# Altium schematic sheet Processor.SchDoc: MCU STM32F407VG6
size A4; Organization: Gadget Sandbox; SheetNumber: 3; SheetTotal: 5; License: CC-BY-SA 3.0; Version: 0.1 pre-alpha; Project: NeoCortex
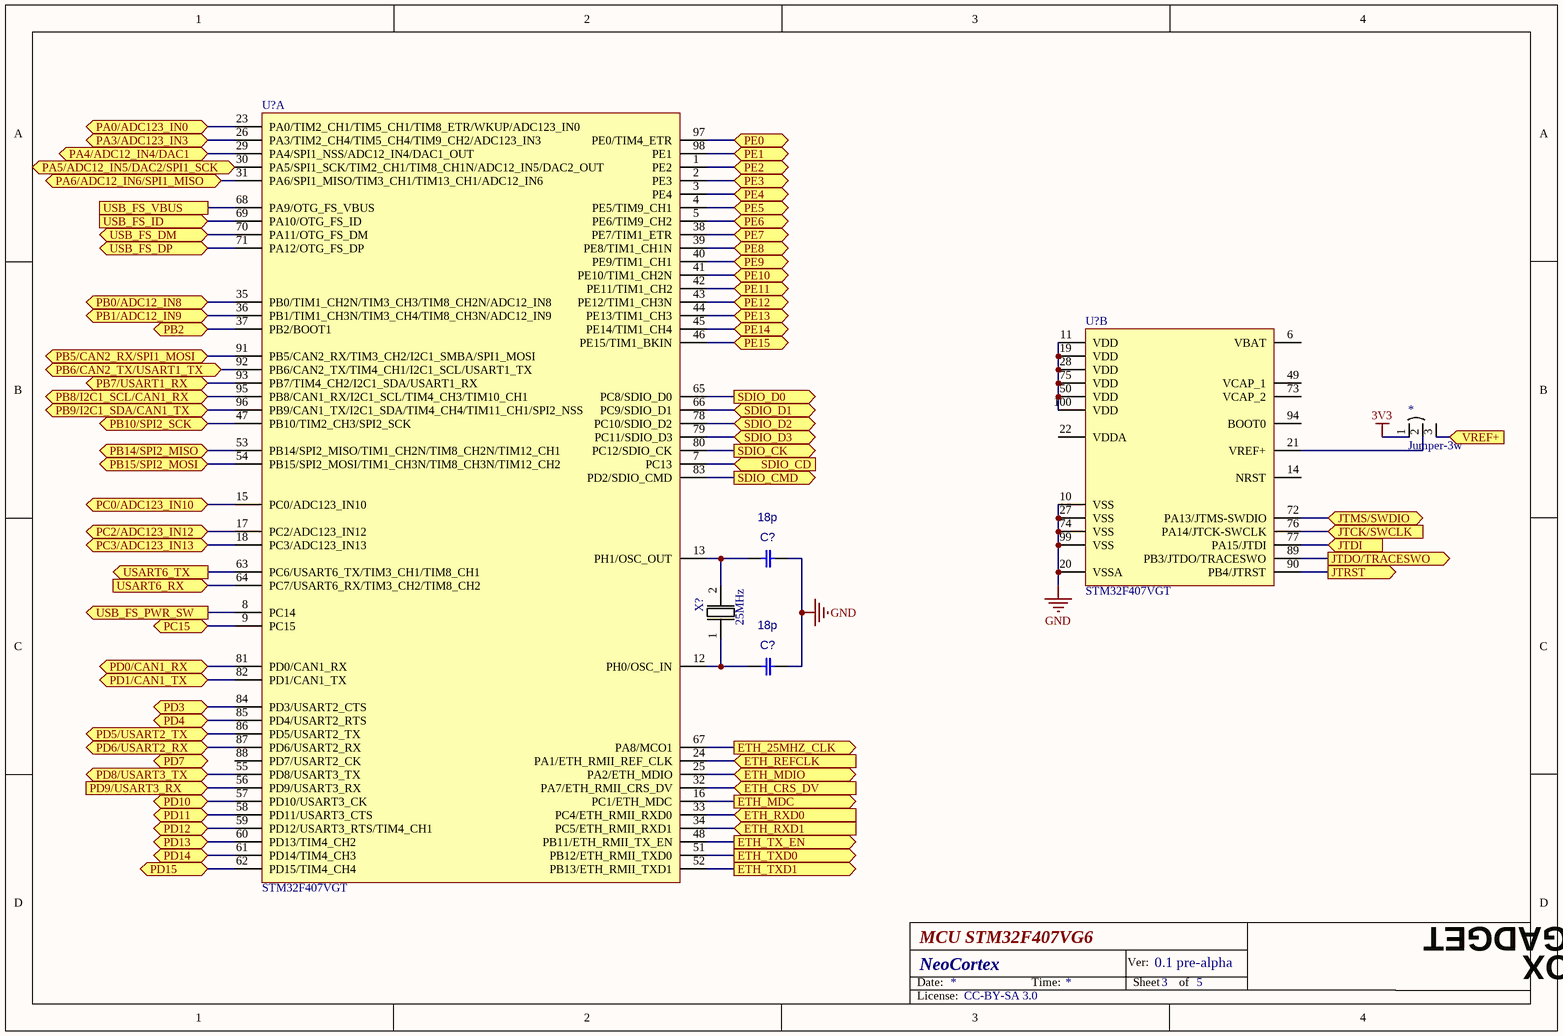
[diagram p0: Processor.SchDoc]

## Parts
(Parts that share a designator on the sheet are numbered #1, #2 ... from top to bottom, then left to right.)
*  Jumper-3w  [JMP-3W]
C?#1  18p  [CAP 0805]
C?#2  18p  [CAP 0805]
U?#1  STM32F407VGT  [LQFP-100 (14x14)]  (part A of 2)
U?#2  STM32F407VGT  [LQFP-100 (14x14)]  (part B of 2)
X?  25MHz  [Crystal SMU4]

## Ports
ETH_25MHZ_CLK (out), ETH_CRS_DV (in), ETH_MDC (out), ETH_MDIO (bidir), ETH_REFCLK (in), ETH_RXD0 (in), ETH_RXD1 (in), ETH_TX_EN (out), ETH_TXD0 (out), ETH_TXD1 (out), JTCK/SWCLK (in), JTDI (in), JTDO/TRACESWO (out), JTMS/SWDIO (bidir), JTRST (out), PA0/ADC123_IN0 (bidir), PA3/ADC123_IN3 (bidir), PA4/ADC12_IN4/DAC1 (bidir), PA5/ADC12_IN5/DAC2/SPI1_SCK (bidir), PA6/ADC12_IN6/SPI1_MISO (bidir), PB0/ADC12_IN8 (bidir), PB1/ADC12_IN9 (bidir), PB2 (bidir), PB5/CAN2_RX/SPI1_MOSI (bidir), PB6/CAN2_TX/USART1_TX (bidir), PB7/USART1_RX (bidir), PB8/I2C1_SCL/CAN1_RX (bidir), PB9/I2C1_SDA/CAN1_TX (bidir), PB10/SPI2_SCK (bidir), PB14/SPI2_MISO (bidir), PB15/SPI2_MOSI (bidir), PC0/ADC123_IN10 (bidir), PC2/ADC123_IN12 (bidir), PC3/ADC123_IN13 (bidir), PC15 (bidir), PD0/CAN1_RX (bidir), PD1/CAN1_TX (bidir), PD3 (bidir), PD4 (bidir), PD5/USART2_TX (bidir), PD6/USART2_RX (bidir), PD7 (bidir), PD8/USART3_TX (bidir), PD9/USART3_RX (in), PD10 (bidir), PD11 (bidir), PD12 (bidir), PD13 (bidir), PD14 (bidir), PD15 (bidir), PE0 (bidir), PE1 (bidir), PE2 (bidir), PE3 (bidir), PE4 (bidir), PE5 (bidir), PE6 (bidir), PE7 (bidir), PE8 (bidir), PE9 (bidir), PE10 (bidir), PE11 (bidir), PE12 (bidir), PE13 (bidir), PE14 (bidir), PE15 (bidir), SDIO_CD (in), SDIO_CK (out), SDIO_CMD (out), SDIO_D0 (out), SDIO_D1 (bidir), SDIO_D2 (bidir), SDIO_D3 (bidir), USART6_RX (in), USART6_TX (out), USB_FS_DM (bidir), USB_FS_DP (bidir), USB_FS_ID (in), USB_FS_PWR_SW (out), USB_FS_VBUS, VREF+ (in)

## Nets
3V3: *.1
GND: C?#1.2 C?#2.2 U?#2.10(VSS) U?#2.20(VSSA) U?#2.27(VSS) U?#2.74(VSS) U?#2.99(VSS)
ETH_25MHZ_CLK: U?#1.67(PA8/MCO1) ; port ETH_25MHZ_CLK
ETH_CRS_DV: U?#1.32(PA7/ETH_RMII_CRS_DV) ; port ETH_CRS_DV
ETH_MDC: U?#1.16(PC1/ETH_MDC) ; port ETH_MDC
ETH_MDIO: U?#1.25(PA2/ETH_MDIO) ; port ETH_MDIO
ETH_REFCLK: U?#1.24(PA1/ETH_RMII_REF_CLK) ; port ETH_REFCLK
ETH_RXD0: U?#1.33(PC4/ETH_RMII_RXD0) ; port ETH_RXD0
ETH_RXD1: U?#1.34(PC5/ETH_RMII_RXD1) ; port ETH_RXD1
ETH_TX_EN: U?#1.48(PB11/ETH_RMII_TX_EN) ; port ETH_TX_EN
ETH_TXD0: U?#1.51(PB12/ETH_RMII_TXD0) ; port ETH_TXD0
ETH_TXD1: U?#1.52(PB13/ETH_RMII_TXD1) ; port ETH_TXD1
JTCK/SWCLK: U?#2.76(PA14/JTCK-SWCLK) ; port JTCK/SWCLK
JTDI: U?#2.77(PA15/JTDI) ; port JTDI
JTDO/TRACESWO: U?#2.89(PB3/JTDO/TRACESWO) ; port JTDO/TRACESWO
JTMS/SWDIO: U?#2.72(PA13/JTMS-SWDIO) ; port JTMS/SWDIO
JTRST: U?#2.90(PB4/JTRST) ; port JTRST
PA0/ADC123_IN0: U?#1.23(PA0/TIM2_CH1/TIM5_CH1/TIM8_ETR/WKUP/ADC123_IN0) ; port PA0/ADC123_IN0
PA3/ADC123_IN3: U?#1.26(PA3/TIM2_CH4/TIM5_CH4/TIM9_CH2/ADC123_IN3) ; port PA3/ADC123_IN3
PA4/ADC12_IN4/DAC1: U?#1.29(PA4/SPI1_NSS/ADC12_IN4/DAC1_OUT) ; port PA4/ADC12_IN4/DAC1
PA5/ADC12_IN5/DAC2/SPI1_SCK: U?#1.30(PA5/SPI1_SCK/TIM2_CH1/TIM8_CH1N/ADC12_IN5/DAC2_OUT) ; port PA5/ADC12_IN5/DAC2/SPI1_SCK
PA6/ADC12_IN6/SPI1_MISO: U?#1.31(PA6/SPI1_MISO/TIM3_CH1/TIM13_CH1/ADC12_IN6) ; port PA6/ADC12_IN6/SPI1_MISO
PB0/ADC12_IN8: U?#1.35(PB0/TIM1_CH2N/TIM3_CH3/TIM8_CH2N/ADC12_IN8) ; port PB0/ADC12_IN8
PB1/ADC12_IN9: U?#1.36(PB1/TIM1_CH3N/TIM3_CH4/TIM8_CH3N/ADC12_IN9) ; port PB1/ADC12_IN9
PB2: U?#1.37(PB2/BOOT1) ; port PB2
PB5/CAN2_RX/SPI1_MOSI: U?#1.91(PB5/CAN2_RX/TIM3_CH2/I2C1_SMBA/SPI1_MOSI) ; port PB5/CAN2_RX/SPI1_MOSI
PB6/CAN2_TX/USART1_TX: U?#1.92(PB6/CAN2_TX/TIM4_CH1/I2C1_SCL/USART1_TX) ; port PB6/CAN2_TX/USART1_TX
PB7/USART1_RX: U?#1.93(PB7/TIM4_CH2/I2C1_SDA/USART1_RX) ; port PB7/USART1_RX
PB8/I2C1_SCL/CAN1_RX: U?#1.95(PB8/CAN1_RX/I2C1_SCL/TIM4_CH3/TIM10_CH1) ; port PB8/I2C1_SCL/CAN1_RX
PB9/I2C1_SDA/CAN1_TX: U?#1.96(PB9/CAN1_TX/I2C1_SDA/TIM4_CH4/TIM11_CH1/SPI2_NSS) ; port PB9/I2C1_SDA/CAN1_TX
PB10/SPI2_SCK: U?#1.47(PB10/TIM2_CH3/SPI2_SCK) ; port PB10/SPI2_SCK
PB14/SPI2_MISO: U?#1.53(PB14/SPI2_MISO/TIM1_CH2N/TIM8_CH2N/TIM12_CH1) ; port PB14/SPI2_MISO
PB15/SPI2_MOSI: U?#1.54(PB15/SPI2_MOSI/TIM1_CH3N/TIM8_CH3N/TIM12_CH2) ; port PB15/SPI2_MOSI
PC0/ADC123_IN10: U?#1.15(PC0/ADC123_IN10) ; port PC0/ADC123_IN10
PC2/ADC123_IN12: U?#1.17(PC2/ADC123_IN12) ; port PC2/ADC123_IN12
PC3/ADC123_IN13: U?#1.18(PC3/ADC123_IN13) ; port PC3/ADC123_IN13
PC15: U?#1.9(PC15) ; port PC15
PD0/CAN1_RX: U?#1.81(PD0/CAN1_RX) ; port PD0/CAN1_RX
PD1/CAN1_TX: U?#1.82(PD1/CAN1_TX) ; port PD1/CAN1_TX
PD3: U?#1.84(PD3/USART2_CTS) ; port PD3
PD4: U?#1.85(PD4/USART2_RTS) ; port PD4
PD5/USART2_TX: U?#1.86(PD5/USART2_TX) ; port PD5/USART2_TX
PD6/USART2_RX: U?#1.87(PD6/USART2_RX) ; port PD6/USART2_RX
PD8/USART3_TX: U?#1.55(PD8/USART3_TX) ; port PD8/USART3_TX
PD9/USART3_RX: U?#1.56(PD9/USART3_RX) ; port PD9/USART3_RX
PD10: U?#1.57(PD10/USART3_CK) ; port PD10
PD11: U?#1.58(PD11/USART3_CTS) ; port PD11
PD12: U?#1.59(PD12/USART3_RTS/TIM4_CH1) ; port PD12
PD13: U?#1.60(PD13/TIM4_CH2) ; port PD13
PD14: U?#1.61(PD14/TIM4_CH3) ; port PD14
PD15: U?#1.62(PD15/TIM4_CH4) ; port PD15
PE0: U?#1.97(PE0/TIM4_ETR) ; port PE0
PE1: U?#1.98(PE1) ; port PE1
PE2: U?#1.1(PE2) ; port PE2
PE3: U?#1.2(PE3) ; port PE3
PE4: U?#1.3(PE4) ; port PE4
PE5: U?#1.4(PE5/TIM9_CH1) ; port PE5
PE6: U?#1.5(PE6/TIM9_CH2) ; port PE6
PE7: U?#1.38(PE7/TIM1_ETR) ; port PE7
PE8: U?#1.39(PE8/TIM1_CH1N) ; port PE8
PE9: U?#1.40(PE9/TIM1_CH1) ; port PE9
PE10: U?#1.41(PE10/TIM1_CH2N) ; port PE10
PE11: U?#1.42(PE11/TIM1_CH2) ; port PE11
PE12: U?#1.43(PE12/TIM1_CH3N) ; port PE12
PE13: U?#1.44(PE13/TIM1_CH3) ; port PE13
PE14: U?#1.45(PE14/TIM1_CH4) ; port PE14
PE15: U?#1.46(PE15/TIM1_BKIN) ; port PE15
SDIO_CD: U?#1.7(PC13) ; port SDIO_CD
SDIO_CK: U?#1.80(PC12/SDIO_CK) ; port SDIO_CK
SDIO_CMD: U?#1.83(PD2/SDIO_CMD) ; port SDIO_CMD
SDIO_D0: U?#1.65(PC8/SDIO_D0) ; port SDIO_D0
SDIO_D1: U?#1.66(PC9/SDIO_D1) ; port SDIO_D1
SDIO_D2: U?#1.78(PC10/SDIO_D2) ; port SDIO_D2
SDIO_D3: U?#1.79(PC11/SDIO_D3) ; port SDIO_D3
USART6_RX: U?#1.64(PC7/USART6_RX/TIM3_CH2/TIM8_CH2) ; port USART6_RX
USART6_TX: U?#1.63(PC6/USART6_TX/TIM3_CH1/TIM8_CH1) ; port USART6_TX
USB_FS_DM: U?#1.70(PA11/OTG_FS_DM) ; port USB_FS_DM
USB_FS_DP: U?#1.71(PA12/OTG_FS_DP) ; port USB_FS_DP
USB_FS_ID: U?#1.69(PA10/OTG_FS_ID) ; port USB_FS_ID
USB_FS_PWR_SW: U?#1.8(PC14) ; port USB_FS_PWR_SW
USB_FS_VBUS: U?#1.68(PA9/OTG_FS_VBUS) ; port USB_FS_VBUS
VREF+: *.3 ; port VREF+
Net*_2: *.2 U?#2.21(VREF+)
NetC?#1_1: C?#1.1 U?#1.13(PH1/OSC_OUT) X?.2
NetC?#2_1: C?#2.1 U?#1.12(PH0/OSC_IN) X?.1
NetU?#2_11: U?#2.11(VDD) U?#2.19(VDD) U?#2.28(VDD) U?#2.50(VDD) U?#2.75(VDD) U?#2.100(VDD)

Not connected (* = marked no-connect by the designer): U?#1 88(PD7/USART2_CK); U?#2 6(VBAT) 14(NRST) 22(VDDA) 49(VCAP_1) 73(VCAP_2) 94(BOOT0)

## Notes on the sheet
- Date:
- Time:
- Ver:
- Sheet
- of
- GADGET
- SANDBOX
- License:

## Library data of the parts
C?#1 C?#2 = Capacitor Ceramic: Value: 18p
U?#1 U?#2 = STM32F407VGT: ARM Cortex-M4 32b MCU+FPU, 210DMIPS, up to 1MB Flash/192+4KB RAM,  USB OTG HS/FS, Ethernet, 17 TIMs, 3 ADCs, 15 comm. interfaces & camera
X? = Crystal: Value: 25MHz